# Altium project Vapeix_EEPROM_TEST.PrjPcb
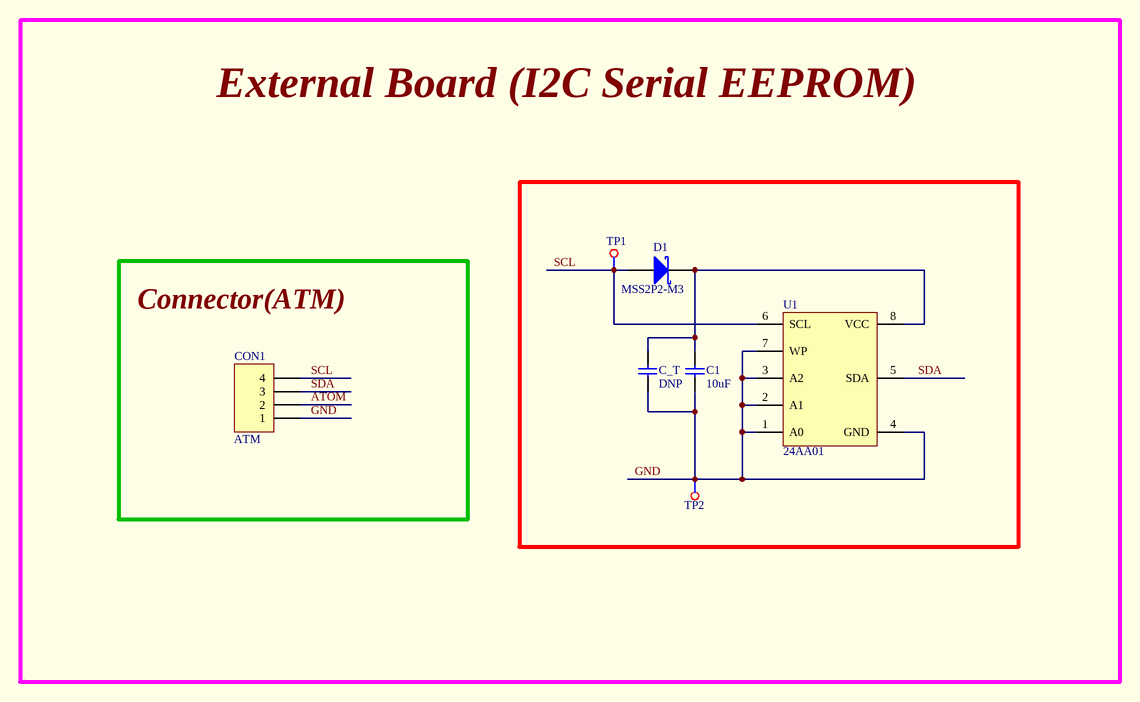
[diagram p0: Vapeix_eeprom_test.SchDoc]
1 sheet, 7 parts. Net scope: global (net labels, ports and power ports of the same name join across sheets).
Board file: Vapeix_EEPROM_TEST.PcbDoc

## Sheet Vapeix_eeprom_test.SchDoc: External Board(I2C Serial EEPROM)
size A4; DrawnBy: Rock Jon; Organization: Altium Limited; Address1: L3, 12a Rodborough Rd; Address2: Frenchs Forest; Address3: NSW; Address4: Australia 2086; DocumentNumber: 1; Revision: v0.1.1; SheetNumber: 1; SheetTotal: 1

### Parts
C1  10uF  [C0402]
C_T  DNP  [C0201]
CON1  ATM  [S4B-PH-K-S]
D1  MSS2P2-M3  [MSS2P2-M3]
TP1  TP  [TP]  (value not drawn)
TP2  TP  [TP]  (value not drawn)
U1  24AA01  [24AA01]

### Nets
ATOM: CON1.2
GND: C1.1 C_T.1 CON1.1 TP2.1(TP) U1.1(A0) U1.2(A1) U1.3(A2) U1.4(GND) U1.7(WP)
SCL: CON1.4 D1.1(A) TP1.1(TP) U1.6(SCL)
SDA: CON1.3 U1.5(SDA)
NetC1_2: C1.2 C_T.2 D1.2(K) U1.8(VCC)

### Notes on the sheet
- Labels drawn without touching a wire or pin: Connector(ATM), External Board (I2C Serial EEPROM)
- Title
- Size:
- Date:
- A4
- Number:
- Time:
- Revision:
- Sheet
- of
- Drawn by:
- File:

### Library data of the parts
C1 C_T = C0402-12p: Capacitor, NP0, ±2%; Note: 50V; Artikkelnr Noca: 20029159; Artikkelnr Simpro: N.A.; Part Number: C0402-12p; Manufacturer: *; Manufacturer Part Number: *; Datasheet: *; LatestRevisionDate: 2011-05-11; Pin Count: 2; Publisher: Nordic Semiconductor; Published: 2009-05-08; Supplier: *; Supplier part number: *; 2nd source Supplier: *; 2nd source part number: *; Footprint Doc: 0402
  C1: Value: 10uF
  C_T: Value: DNP
CON1 = S4B-PH-K-S(LF)(SN): CONN HEADER PH SIDE 4POS 2MM; Manufacturer: JST Sales America Inc.; Connector Type: Header, Shrouded; Number of Positions: 4; Number of Positions Loaded: All; Pitch: 0.079" (2.00mm); Supplier 1: Digi-Key; Manufacturer Part Number: S4B-PH-K-S(LF)(SN); RoHS: RoHS Compliant; Category: Connectors, Interconnects; Stock 1: 41576; Pricing 1: 1=0.22, 10=0.208, 25=0.1772, 50=0.155, 100=0.144, 250=0.1274, 500=0.12186, 1000=0.0997, 2500=0.09139 (USD); Packaging: Bulk; Contact Type: Male Pin; Number of Rows: 1; Row Spacing: -; Contact Mating Length: 0.130" (3.30mm); Mounting Type: Through Hole, Right Angle; Termination: Press-Fit, Solder; Fastening Type: Detent Lock; Features: -; Contact Finish: Tin; Contact Finish Thickness: -; Color: Natural; ComponentLink1URL: http://www.jst-mfg.com/product/pdf/eng/ePH.pdf; ComponentLink1Description: http://www.jst-mfg.com/product/pdf/eng/ePH.pdf
D1 = MSS2P2-M3/89A: DIODE SCHOTTKY 20V 2A MICROSMP; Manufacturer: Vishay Semiconductor Diodes Division; Voltage - Forward (Vf) (Max) @ If: 600mV @ 2A; Speed: Fast Recovery =< 500ns, > 200mA (Io); Current - Reverse Leakage @ Vr: 250µA @ 20V; Capacitance @ Vr, F: 65pF @ 4V, 1MHz; Supplier 1: Digi-Key; Manufacturer Part Number: MSS2P2-M3/89A; RoHS: RoHS Compliant; Category: Discrete Semiconductor Products; Stock 1: 3961; Pricing 1: 1=0.37, 10=0.274, 100=0.1552, 500=0.1029, 1000=0.07892 (USD); Packaging: Digi-Reel®; Diode Type: Schottky; Voltage - DC Reverse (Vr) (Max): 20V; Current - Average Rectified (Io): 2A; Reverse Recovery Time (trr): -; Mounting Type: Surface Mount; Package / Case: MicroSMP; Supplier Device Package: MicroSMP; Operating Temperature - Junction: -55°C ~ 150°C; ComponentLink1URL: http://www.vishay.com/docs/89054/mss2p3.pdf; ComponentLink1Description: http://www.vishay.com/docs/89054/mss2p3.pdf
TP1 TP2 = TP: TEST POINT
U1 = 24AA01-I/SN: IC EEPROM 1KBIT 400KHZ 8SOIC; Manufacturer: Microchip Technology; Format - Memory: EEPROMs - Serial; Memory Size: 1K (128 x 8); Speed: 100kHz, 400kHz; Interface: I²C, 2-Wire Serial; Voltage - Supply: 1.7 V ~ 5.5 V; Supplier 1: Digi-Key; Manufacturer Part Number: 24AA01-I/SN; RoHS: RoHS Compliant; Category: Integrated Circuits (ICs); Stock 1: 5232; Pricing 1: 1=0.2, 100=0.19 (USD); Packaging: Tube; Memory Type: EEPROM; Operating Temperature: -40°C ~ 85°C (TA); Package / Case: 8-SOIC (0.154", 3.90mm Width); Supplier Device Package: 8-SOIC; ComponentLink1URL: http://www.microchip.com/mymicrochip/filehandler.aspx?ddocname=en011831; ComponentLink1Description: http://www.microchip.com/mymicrochip/filehandler.aspx?ddocname=en011831